# EAGLE design ASD2002 (EAGLE 6.3)
DATABASE: ./../../../../../Components/TinyCircuits_Part_Database.txt
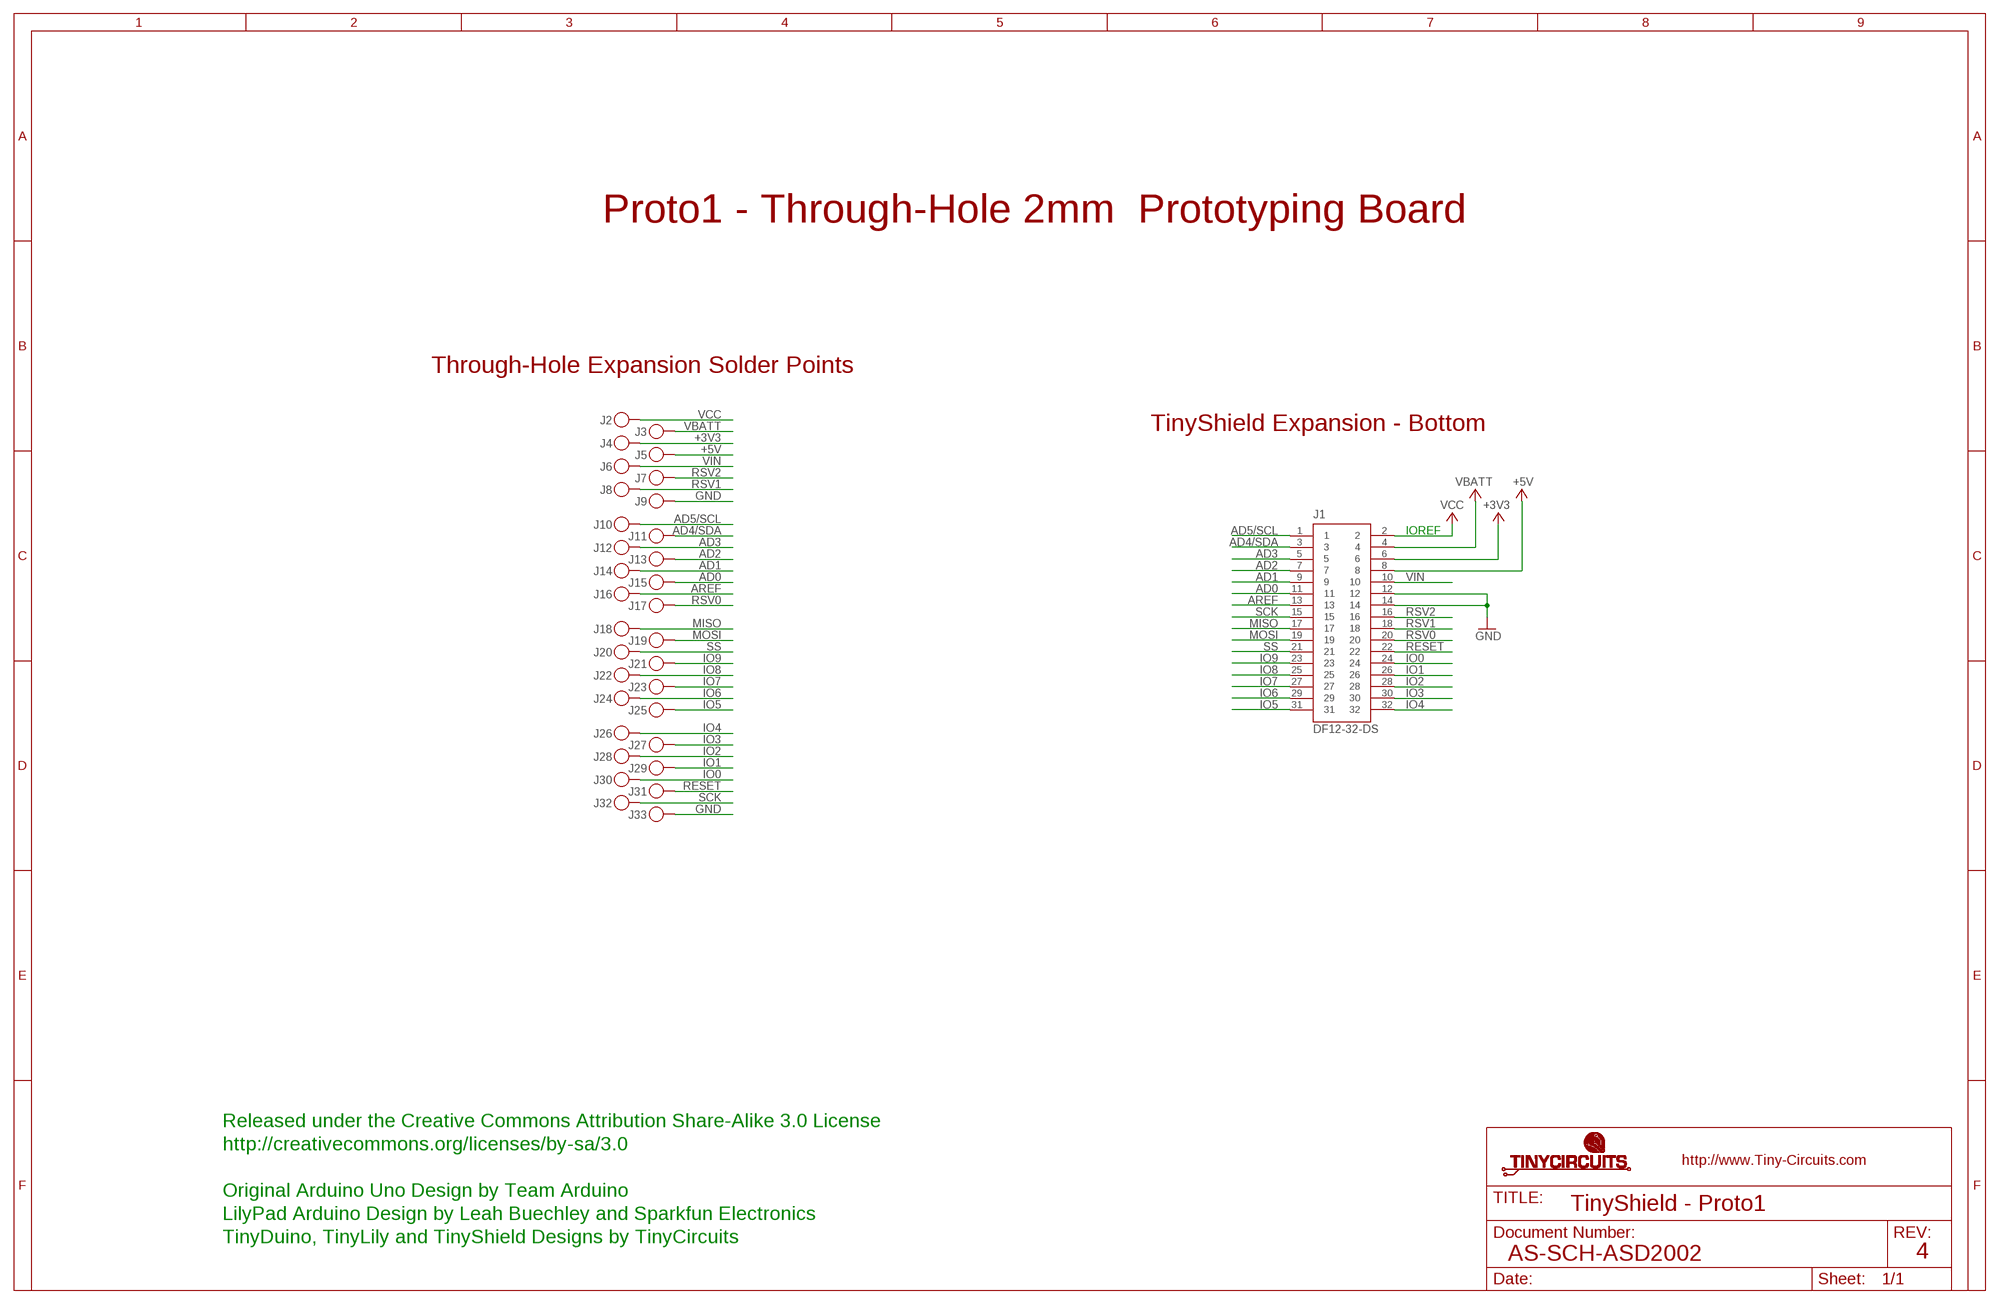
[diagram p0: schematic, sheet 1]

## Parts
J1  DF12-32-DS  AS-ITM-00012  [DF12-32-DS]
J2  PIN_1X.1"  [1X.1"]
J3  PIN_1X.1"  [1X.1"]
J4  PIN_1X.1"  [1X.1"]
J5  PIN_1X.1"  [1X.1"]
J6  PIN_1X.1"  [1X.1"]
J7  PIN_1X.1"  [1X.1"]
J8  PIN_1X.1"  [1X.1"]
J9  PIN_1X.1"  [1X.1"]
J10  PIN_1X.1"  [1X.1"]
J11  PIN_1X.1"  [1X.1"]
J12  PIN_1X.1"  [1X.1"]
J13  PIN_1X.1"  [1X.1"]
J14  PIN_1X.1"  [1X.1"]
J15  PIN_1X.1"  [1X.1"]
J16  PIN_1X.1"  [1X.1"]
J17  PIN_1X.1"  [1X.1"]
J18  PIN_1X.1"  [1X.1"]
J19  PIN_1X.1"  [1X.1"]
J20  PIN_1X.1"  [1X.1"]
J21  PIN_1X.1"  [1X.1"]
J22  PIN_1X.1"  [1X.1"]
J23  PIN_1X.1"  [1X.1"]
J24  PIN_1X.1"  [1X.1"]
J25  PIN_1X.1"  [1X.1"]
J26  PIN_1X.1"  [1X.1"]
J27  PIN_1X.1"  [1X.1"]
J28  PIN_1X.1"  [1X.1"]
J29  PIN_1X.1"  [1X.1"]
J30  PIN_1X.1"  [1X.1"]
J31  PIN_1X.1"  [1X.1"]
J32  PIN_1X.1"  [1X.1"]
J33  PIN_1X.1"  [1X.1"]

## Nets
+3V3: J1.6 J4.1
+5V: J1.8 J5.1
AD0: J1.11 J15.1
AD1: J1.9 J14.1
AD2: J1.7 J13.1
AD3: J1.5 J12.1
AD4/SDA: J1.3 J11.1
AD5/SCL: J1.1 J10.1
AREF: J1.13 J16.1
GND: J1.12 J1.14 J9.1 J33.1
IO0: J1.24 J30.1
IO1: J1.26 J29.1
IO2: J1.28 J28.1
IO3: J1.30 J27.1
IO4: J1.32 J26.1
IO5: J1.31 J25.1
IO6: J1.29 J24.1
IO7: J1.27 J23.1
IO8: J1.25 J22.1
IO9: J1.23 J21.1
MISO: J1.17 J18.1
MOSI: J1.19 J19.1
RESET: J1.22 J31.1
RSV0: J1.20 J17.1
RSV1: J1.18 J8.1
RSV2: J1.16 J7.1
SCK: J1.15 J32.1
SS: J1.21 J20.1
VBATT: J1.4 J3.1
VCC: J1.2 J2.1
VIN: J1.10 J6.1

## Notes on the sheet
- Proto1 - Through-Hole 2mm  Prototyping Board
- Through-Hole Expansion Solder Points
- TinyShield Expansion - Bottom
- IOREF
- Released under the Creative Commons Attribution Share-Alike 3.0 License
- http://creativecommons.org/licenses/by-sa/3.0
- Original Arduino Uno Design by Team Arduino
- TinyShield - Proto1
- LilyPad Arduino Design by Leah Buechley and Sparkfun Electronics
- TinyDuino, TinyLily and TinyShield Designs by TinyCircuits
- AS-SCH-ASD2002 | 4

## Library data of the parts
J1 = tinycircuits:AS-ITM-00012: CONN RECEPT 32POS 3MM SMD 0.5MM; PARTNO: AS-ITM-00012
J2-J33 = tinycircuits:PIN_1X.1": 1 Pin 0.100" Header; BOM: EXCLUDE; DNP: T; PARTNO: COPPER

## Board
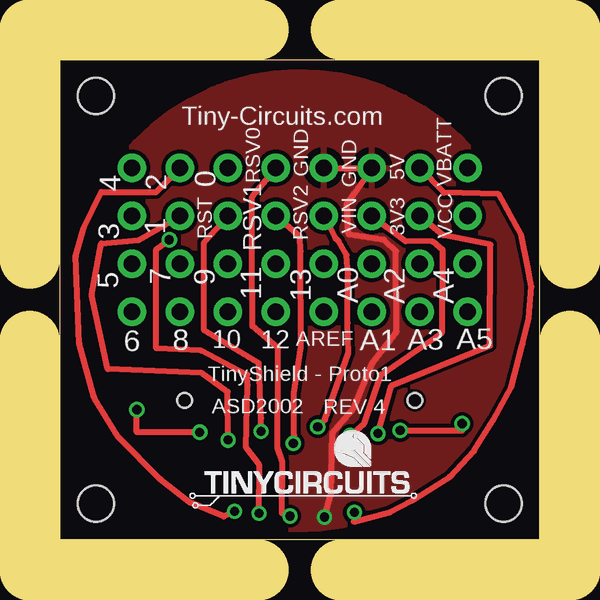
[diagram p1: board, top side]
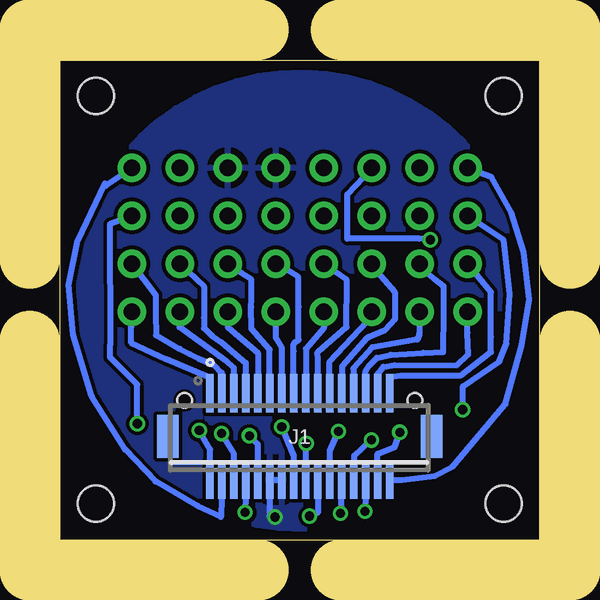
[diagram p2: board, bottom side, seen from below]

Size 20 x 20 mm. Coordinates in mm from the lower left corner, seen from the top.
Outline: 0,0 0,20 20,20 20,0 0,0
Copper layers (1*16): Top 0.035mm / dielectric 1.5mm / Bottom 0.035mm
Design rules "default *": minimum track width 8mil, minimum drill 15mil, track to track 6mil, track to pad 6mil, pad to pad 6mil, via to via 6mil, smd to smd 6mil, copper to edge 6mil, drill to drill 8mil, minimum pad ring 10mil, minimum via ring 5mil, stop-mask expansion 4mil, vias tented up to drill 25mil, thermal gap 10mil
Holes 1.5 mm at 1.5,18.5 18.5,18.5 18.5,1.5 1.5,1.5
Milling: 8 lines

### Footprints (pad centres in the part's own frame; a part is rotated, then mirrored left to right if it is on the bottom)
DF12-32-DS = smd 0.3 x 1.6: 1 -3.75,1.8; 2 -3.75,-1.8; 3 -3.25,1.8; 4 -3.25,-1.8; 5 -2.75,1.8; 6 -2.75,-1.8; 7 -2.25,1.8; 8 -2.25,-1.8; 9 -1.75,1.8; 10 -1.75,-1.8; 11 -1.25,1.8; 12 -1.25,-1.8; 13 -0.75,1.8; 14 -0.75,-1.8; 15 -0.25,1.8; 16 -0.25,-1.8; 17 0.25,1.8; 18 0.25,-1.8; 19 0.75,1.8; 20 0.75,-1.8; 21 1.25,1.8; 22 1.25,-1.8; 23 1.75,1.8; 24 1.75,-1.8; 25 2.25,1.8; 26 2.25,-1.8; 27 2.75,1.8; 28 2.75,-1.8; 29 3.25,1.8; 30 3.25,-1.8; 31 3.75,1.8; 32 3.75,-1.8 | smd 0.9 x 1.8: F1 -5.5,0; F2 5.5,0 | hole 0.6: -4.8,1.5; 4.8,1.5
1X.1" = drill 0.7 pad 1.016: 1 0,0

### Placement (x,y rotation side)
J1  10,4.3 0 bottom
J2  17,13.5 0 top
J3  17,15.5 0 top
J4  15,13.5 0 top
J5  15,15.5 0 top
J6  13,13.5 0 top
J7  11,13.5 0 top
J8  9,13.5 0 top
J9  13,15.5 0 top
J10  17,9.5 0 top
J11  17,11.5 0 top
J12  15,9.5 0 top
J13  15,11.5 0 top
J14  13,9.5 0 top
J15  13,11.5 0 top
J16  11,9.5 0 top
J17  9,15.5 0 top
J18  9,9.5 0 top
J19  9,11.5 0 top
J20  7,9.5 0 top
J21  7,11.5 0 top
J22  5,9.5 0 top
J23  5,11.5 0 top
J24  3,9.5 0 top
J25  3,11.5 0 top
J26  3,15.5 0 top
J27  3,13.5 0 top
J28  5,15.5 0 top
J29  5,13.5 0 top
J30  7,15.5 0 top
J31  7,13.5 0 top
J32  11,11.5 0 top
J33  11,15.5 0 top
U$1  [DOCFIELD-TINYCIRCUITS-PCB]  33.91,-10 0 top  (outside the outline)

### Tracks (layer width: path | path; a pad name or v marks a point on that pad's centre or on a via)
+3V3  (via drill 0.38)
  Top 0.254: v13.26,4.42 13.83,6.42 17.93,8.09 17.95,12.3 15.97,12.69 J4.1
  Bottom 0.254: J1.6 12.74,3.59 v13.26,4.42
+5V  (via drill 0.38)
  Top 0.254: v12.28,1.13 12.26,0.75 13.74,1.13 14.69,1.63 16.26,2.62 17.27,3.69 18.07,4.98 18.82,6.36 19.29,8.14 19.55,9.22 19.66,10.55 19.51,11.37 19.23,12.7 18.3,14.4 16,14.46 J5.1
  Bottom 0.254: J1.8 v12.28,1.13
AD0
  Bottom 0.254: J1.11 11.25,6.69 11.25,7.92 12.01,8.79 12.02,9.71 12.01,10.01 12.01,10.84 12.44,11.12 J15.1
AD1
  Bottom 0.254: J14.1 13,8.85 11.75,7.79 11.75,6.23 J1.9
AD2
  Bottom 0.254: J13.1 13.99,10.56 14,9.24 13.99,8.82 13.67,8.52 13.27,8.22 12.26,7.37 12.26,6.14 J1.7
AD3
  Bottom 0.254: J12.1 15.02,8.86 13.35,7.65 13.09,7.46 12.76,7.16 12.75,6.13 J1.5
AD4/SDA
  Bottom 0.254: J11.1 16,10.19 16,9.41 15.99,8.52 15.01,7.95 14.59,7.73 14.22,7.55 13.58,7.27 13.25,6.95 13.26,6.11 J1.3
AD5/SCL
  Bottom 0.254: J1.1 13.76,6.25 13.78,6.76 15.55,7.52 17.03,8.2 17.02,8.84 J10.1
AREF
  Bottom 0.254: J1.13 10.75,8.01 11,8.42 10.99,9.48 J16.1
GND  (via drill 0.38)
  Top 0.254: v11.03,0.94 11.31,1.91 11.36,4.44 12.26,5.5 13.03,7.37 14.04,8.66 14.02,12.03 13.53,12.5 12.04,12.72 11.97,14.04 12.22,14.35 | 12.22,14.35 12.26,14.42 | 12.22,14.35 12.24,14.39 J9.1 J33.1
  Bottom 0.254: J1.14 J1.12 11.27,0.98 v11.03,0.94
  pour Top: 18.49,5.61 arc180 1.54,14.32 arc180
  pour Bottom: 18.49,5.61 arc180 1.54,14.32 arc180
IO0  (via drill 0.38)
  Top 0.254: v8.3,1.09 8.32,3.11 7.75,3.85 7.83,6.44 7.81,6.87 5.89,7.88 4.02,7.97 4.02,12.1 v4.56,12.5
  Bottom 0.254: J1.24 v8.3,1.09 | v4.56,12.5 5.03,12.55 8.02,12.55 8.02,14.4 J30.1
IO1  (via drill 0.38)
  Top 0.254: v7.01,4.15 6.99,6.16 5.91,6.94 1.99,7.11 1.33,10.2 1.72,12.35 3.28,12.48 J29.1
  Bottom 0.254: J1.26 7.72,3.5 v7.01,4.15
IO2  (via drill 0.38)
  Top 0.254: v7.28,1.18 6.83,0.96 5.41,1.55 4.18,2.52 2.42,4.29 1.43,5.91 0.81,8.18 0.66,11.82 0.99,13 1.72,14.5 4.01,14.48 J28.1
  Bottom 0.254: J1.28 v7.28,1.18
IO3  (via drill 0.38)
  Top 0.254: v5.83,4.47 3.21,4.47 v3.21,5.42
  Bottom 0.254: J1.30 6.76,3.58 6.04,3.86 v5.83,4.47 | J27.1 1.49,12.48 1.25,10.24 1.38,8.16 1.67,7.43 3.19,6.39 3.19,5.44 v3.21,5.42
IO4
  Bottom 0.254: J1.32 5.75,2.48 4.37,2.65 3.64,3.04 1.42,5.65 0.75,8.11 0.43,10.01 0.66,11.96 1.18,13.64 2.01,15.11 2.99,15.47 J26.1
IO5
  Bottom 0.254: J1.31 6.25,6.77 5.79,6.84 3.46,6.84 3.28,6.85 2.03,7.82 2.03,8.46 2.03,10.32 J25.1
IO6
  Bottom 0.254: J1.29 6.78,5.56 6.77,5.56 6.76,6.86 6.75,6.91 6.52,7.2 6.03,7.27 3.45,7.26 2.97,7.72 3,8.62 J24.1
IO7
  Bottom 0.254: J1.27 7.26,7.02 7.09,7.27 6.79,7.58 6.21,7.7 4.85,7.79 4.02,7.82 3.99,9.48 3.99,10.56 4.36,10.84 5.08,11.49 J23.1
IO8
  Bottom 0.254: J22.1 5.02,8.57 5.1,8.34 6.97,8.02 7.76,7.13 7.75,6.17 7.78,6.14 7.78,6.13 J1.25
IO9
  Bottom 0.254: J21.1 6.63,11.01 6.04,10.31 6.04,9.17 6.45,8.72 7.19,8.41 8.23,7.22 8.23,6.12 J1.23
MISO
  Bottom 0.254: J18.1 9,8.81 9.74,7.95 9.74,6.41 J1.17
MOSI
  Bottom 0.254: J1.19 9.25,7.52 9.25,7.81 9.2,7.86 8.05,8.86 8.04,10.82 J19.1
RESET  (via drill 0.38)
  Top 0.254: v8.39,4.51 8.39,5.07 8.3,7.35 6.02,8.72 6.02,12.4 J31.1
  Bottom 0.254: J1.22 8.75,3.69 v8.39,4.51
RSV0  (via drill 0.38)
  Top 0.254: v9.59,0.98 9.26,1.1 9.28,3.25 9.07,3.85 9.09,6.85 9.1,8 8.03,8.9 8.01,11.94 8.01,12.69 8.02,14.3 J17.1
  Bottom 0.254: J1.20 9.25,1.12 v9.59,0.98
RSV1  (via drill 0.38)
  Top 0.254: v9.73,4.01 9.77,4.35 9.75,6.12 10.05,8.04 10.04,12.03 10,12.64 J8.1
  Bottom 0.254: J1.18 v9.73,4.01
RSV2  (via drill 0.38)
  Top 0.254: v10.75,4.7 11.06,5.01 12.03,7.78 11.99,9.04 12.02,11.07 11.95,11.86 11.62,12.44 11.48,12.58 | 11.48,12.58 11.5,12.54 | J7.1 11.48,12.58
  Bottom 0.254: J1.16 10.24,3.5 v10.75,4.7
SCK
  Bottom 0.254: J1.15 10.27,5.91 10.26,6.04 10.26,7.85 10.25,8.16 10.2,8.22 10.05,8.33 10.05,9.7 10.05,9.75 10.05,10.94 10.55,11.25 10.54,11.24 J32.1
SS
  Bottom 0.254: J20.1 7.18,9.1 8.77,7.38 8.77,6.18 J1.21
VBATT
  Bottom 0.254: J1.4 13.29,0.94 14.28,1.41 16.02,2.42 17.29,3.76 18.67,5.97 19.44,8.53 19.64,10.61 19.27,12.46 18.13,14.85 18.17,14.75 18.08,14.76 J3.1
VCC  (via drill 0.38)
  Top 0.254: v14.19,4.55 16.77,4.55 v16.77,4.83
  Bottom 0.254: J1.2 13.73,3.76 v14.19,4.55 | J2.1 17.91,13.15 17.89,8.12 17.91,8.09 17.91,7.6 16.77,6.46 v16.77,4.83
VIN  (via drill 0.38)
  Top 0.254: v12.1,4.33 12.69,4.85 13.38,6.87 15.94,8.64 15.96,12.08 15.55,12.42 14.41,12.44 J6.1
  Bottom 0.254: v12.1,4.33 11.76,3.97 J1.10

### Text on the board
tPlace: Tiny-Circuits.com | RSV0 | 4 | 2 | 0 | GND | GND | 5V | VBATT | VCC | 3 | 1 | RST | VIN | 3V3 | RSV1 | RSV2 | 7 | 9 | 5 | 11 | 13 | A0 | A2 | A4 | 6 | AREF | A1 | A3 | A5 | 8 | 10 | 12 | TinyShield - Proto1 | ASD2002 | REV 4
Document: FABRICATION DRAWING | NOTES: | 1. PRINTED CIRCUIT BOARD MADE FROM NEMA GRADE FR-4 EPOXY LAMINATE | WITH 1 OUNCE COPPER PLATING AND .024 THICKNESS. | 2. ALL DIMENSIONS ARE GIVEN IN INCHES. | 3. CIRCUIT PATHS ARE FOR REFERENCE ONLY. | 4. HOLE SIZES SHOWN ARE FINISHED DIAMETERS AFTER PLATING. | 5. BOARD PLATED USING REFLOW OR SIMILAR METHOD. | 6. BOARD TO HAVE BLUE SOLDER MASK ON PLATED SURFACES USING WET FILM | 7. SILKSCREEN BOARD USING WHITE INK. | SR100 OR SR1010 EPOXY. EQUIVALENT WET OR DRY FILM MAY BE USED. | 8. THE FOLLOWING INFORMATION APPLIES TO THIS BOARD: | * 2 COPPER LAYERS | * .024 BOARD THICKNESS | * REQUIRES TOP SIDE SILKSCREEN | Released under the Creative Commons Attribution Share-Alike 3.0 License | http://creativecommons.org/licenses/by-sa/3.0 | Original Arduino Uno Design by Team Arduino | LilyPad Arduino Design by Leah Buechley and Sparkfun Electronics | TinyDuino, TinyLily and TinyShield Designs by TinyCircuits | TinyShield - Proto1 | AS-PCB-ASD2002 | 4 | 1/1